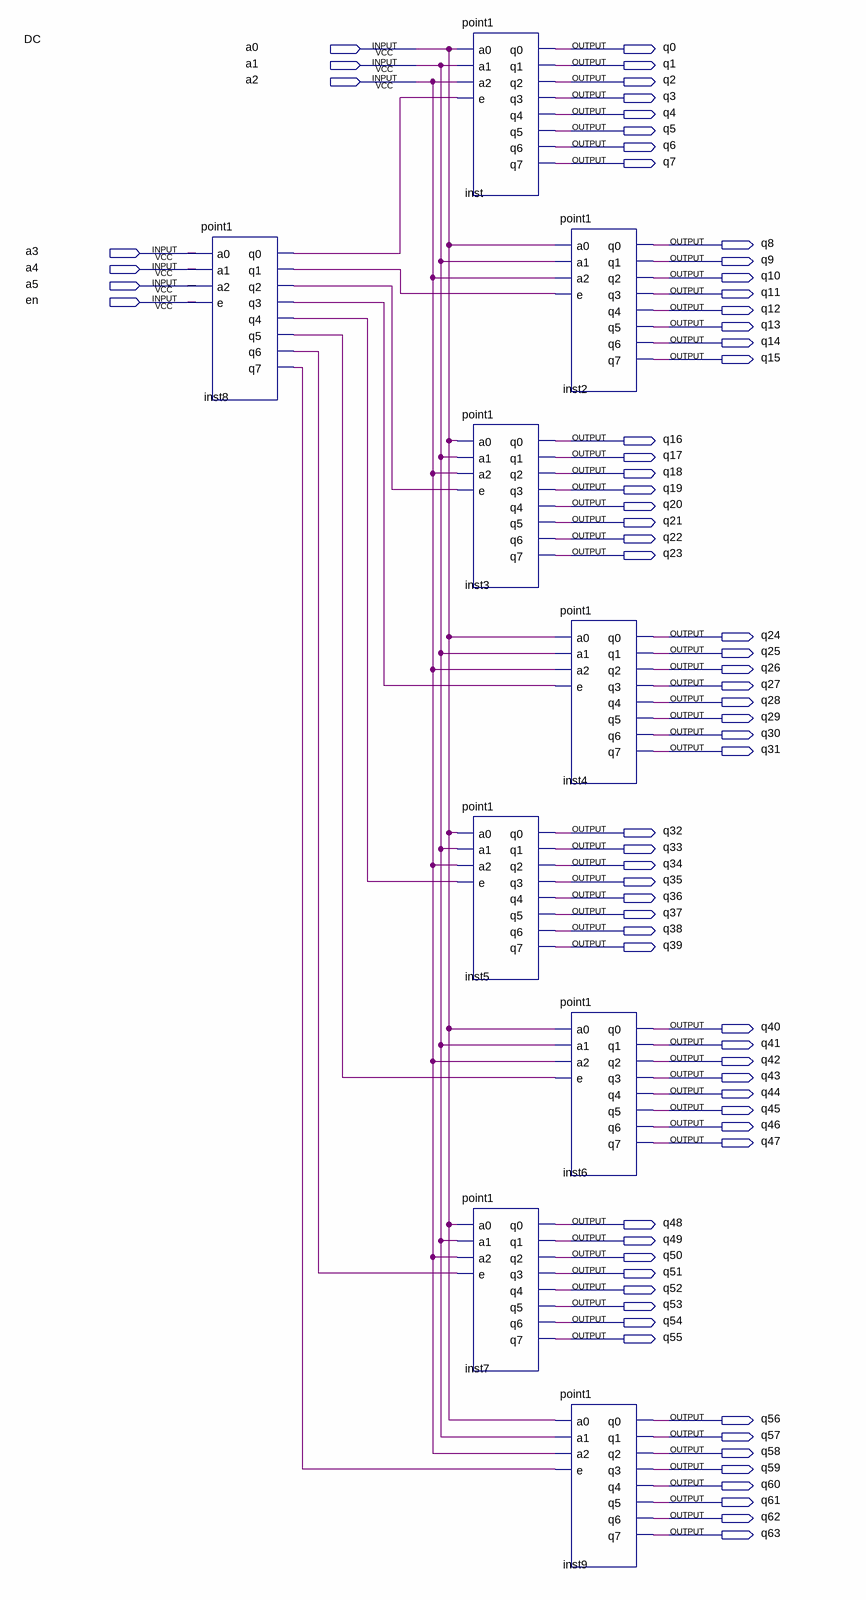
[diagram p0: schematic sheet]
// Quartus schematic point2.bdf as structural Verilog: 9 symbols, 71 pins
module point2 (
  input  a0,
  input  a1,
  input  a2,
  input  a3,
  input  a4,
  input  a5,
  input  en,
  output q0,
  output q1,
  output q2,
  output q3,
  output q4,
  output q5,
  output q6,
  output q7,
  output q8,
  output q9,
  output q10,
  output q11,
  output q12,
  output q13,
  output q14,
  output q15,
  output q16,
  output q17,
  output q18,
  output q19,
  output q20,
  output q21,
  output q22,
  output q23,
  output q24,
  output q25,
  output q26,
  output q27,
  output q28,
  output q29,
  output q30,
  output q31,
  output q32,
  output q33,
  output q34,
  output q35,
  output q36,
  output q37,
  output q38,
  output q39,
  output q40,
  output q41,
  output q42,
  output q43,
  output q44,
  output q45,
  output q46,
  output q47,
  output q48,
  output q49,
  output q50,
  output q51,
  output q52,
  output q53,
  output q54,
  output q55,
  output q56,
  output q57,
  output q58,
  output q59,
  output q60,
  output q61,
  output q62,
  output q63
);

  wire inst8_q0, inst8_q1, inst8_q2, inst8_q3, inst8_q4, inst8_q5, inst8_q6, inst8_q7;

  point1 inst8 (
    .a0(a3), .a1(a4), .a2(a5), .e(en), .q0(inst8_q0), .q1(inst8_q1), .q2(inst8_q2), .q3(inst8_q3),
    .q4(inst8_q4), .q5(inst8_q5), .q6(inst8_q6), .q7(inst8_q7));
  point1 inst (
    .a0(a0), .a1(a1), .a2(a2), .e(inst8_q0), .q0(q0), .q1(q1), .q2(q2), .q3(q3), .q4(q4), .q5(q5), .q6(q6),
    .q7(q7));
  point1 inst3 (
    .a0(a0), .a1(a1), .a2(a2), .e(inst8_q2), .q0(q16), .q1(q17), .q2(q18), .q3(q19), .q4(q20), .q5(q21),
    .q6(q22), .q7(q23));
  point1 inst5 (
    .a0(a0), .a1(a1), .a2(a2), .e(inst8_q4), .q0(q32), .q1(q33), .q2(q34), .q3(q35), .q4(q36), .q5(q37),
    .q6(q38), .q7(q39));
  point1 inst7 (
    .a0(a0), .a1(a1), .a2(a2), .e(inst8_q6), .q0(q48), .q1(q49), .q2(q50), .q3(q51), .q4(q52), .q5(q53),
    .q6(q54), .q7(q55));
  point1 inst2 (
    .a0(a0), .a1(a1), .a2(a2), .e(inst8_q1), .q0(q8), .q1(q9), .q2(q10), .q3(q11), .q4(q12), .q5(q13),
    .q6(q14), .q7(q15));
  point1 inst4 (
    .a0(a0), .a1(a1), .a2(a2), .e(inst8_q3), .q0(q24), .q1(q25), .q2(q26), .q3(q27), .q4(q28), .q5(q29),
    .q6(q30), .q7(q31));
  point1 inst6 (
    .a0(a0), .a1(a1), .a2(a2), .e(inst8_q5), .q0(q40), .q1(q41), .q2(q42), .q3(q43), .q4(q44), .q5(q45),
    .q6(q46), .q7(q47));
  point1 inst9 (
    .a0(a0), .a1(a1), .a2(a2), .e(inst8_q7), .q0(q56), .q1(q57), .q2(q58), .q3(q59), .q4(q60), .q5(q61),
    .q6(q62), .q7(q63));

  // Other names for the same wires on the sheet: DC = a0
endmodule
